# Altium schematic sheet Opto.SchDoc: Quad Optoisolator
size A4; DocumentNumber: 5; SheetNumber: 4; SheetTotal: 9
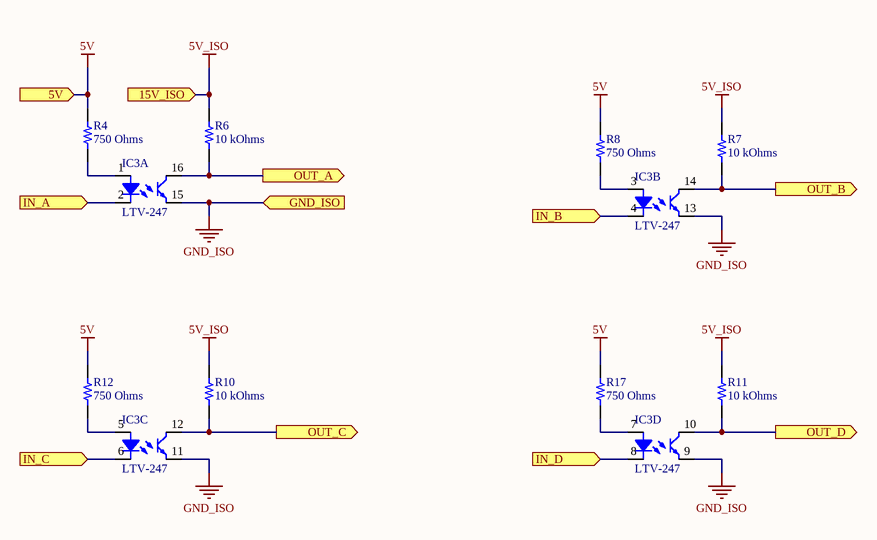
[diagram p0: Opto.SchDoc]

## Parts
IC3  LTV-247  [LITEON SOIC-16 LTV-247]  (parts A,B,C,D of 4)
R4  750 Ohms  [RES 0603_1608]
R6  10 kOhms  [RES 0603_1608]
R7  10 kOhms  [RES 0603_1608]
R8  750 Ohms  [RES 0603_1608]
R10  10 kOhms  [RES 0603_1608]
R11  10 kOhms  [RES 0603_1608]
R12  750 Ohms  [RES 0603_1608]
R17  750 Ohms  [RES 0603_1608]

## Ports
5V (in, see SSR_switch[2A], AC current measurement[1A], Connectors[3A], SSR_switch[1A], Supply 5V[2B], Supply 15V[2B]), 15V_ISO (in, see SSR_switch[2A], AC current measurement[1C], SSR_switch[1A]), GND_ISO (in, see SSR_switch[2A], AC current measurement[1D], SSR_switch[1B], Supply 5V[3C], Supply 15V[3C]), IN_A (in, see SSR_switch[2A]), IN_B (in, see SSR_switch[2A]), IN_C (in, see SSR_switch[2A]), IN_D (in, see SSR_switch[2A]), OUT_A (out, see SSR_switch[2A]), OUT_B (out, see SSR_switch[2A]), OUT_C (out, see SSR_switch[2A]), OUT_D (out, see SSR_switch[2A])

## Nets
5V: R4.2 R8.2 R12.1 R17.1 ; port 5V
5V_ISO: R6.2 R7.2 R10.2 R11.2 ; port 15V_ISO
GND_ISO: IC3.9 IC3.11 IC3.13 IC3.15 ; port GND_ISO
IN_A: IC3.2 ; port IN_A
IN_B: IC3.4 ; port IN_B
IN_C: IC3.6 ; port IN_C
IN_D: IC3.8 ; port IN_D
OUT_A: IC3.16 R6.1 ; port OUT_A
OUT_B: IC3.14 R7.1 ; port OUT_B
OUT_C: IC3.12 R10.1 ; port OUT_C
OUT_D: IC3.10 R11.1 ; port OUT_D
NetIC3_1: IC3.1 R4.1
NetIC3_3: IC3.3 R8.1
NetIC3_5: IC3.5 R12.2
NetIC3_7: IC3.7 R17.2

## Notes on the sheet
- Title
- Size:
- Date:
- A4
- Number:
- Time:
- Revision:
- Sheet
- of
- File:

## Library data of the parts
IC3 = LTV-247: OPTOISO 3.75KV 4CH TRANS 16SO; Manufacturer: Lite-On Inc.; Current - DC Forward (If) (Max): 50mA; Current Transfer Ratio (Max): 600% @ 5mA; Current Transfer Ratio (Min): 50% @ 5mA; Input Type: DC; Number of Channels: 4; Output Type: Transistor; Rise / Fall Time (Typ): 2µs, 3µs; Turn On / Turn Off Time (Typ): 3µs, 3µs; Vce Saturation (Max): 400mV; Voltage - Forward (Vf) (Typ): 1.2V; Voltage - Isolation: 3750Vrms; Voltage - Output (Max): 80V; Part Number: LTV-247; ComponentLink1Description: Datasheet; ComponentLink1URL: http://optoelectronics.liteon.com/upload/download/DS70-2009-0014/LTV-2X7%20sereis%20Mar17.PDF; ComponentLink2Description: DigiKey Link; ComponentLink2URL: http://digikey.com/product-detail/en/lite-on-inc/LTV-247/160-2255-1-ND/8042559; Current - Output / Channel: 50mA; LastUpdated: 6/12/2023 2:51:07 PM; Lifecycle Status: Active; Minimum Order: 1; Mounting Type: Surface Mount; Operating Temperature: -55°C ~ 110°C; Package / Case: 16-SOIC (0.173", 4.40mm Width); Packaging: TapeAndReel; Part Status: Active; Price: 0.43; Series: -; Supplier 1: DigiKey; Supplier Part Number 1: 160-2255-1-ND; Supplier Device Package: 16-SO
R4 R8 R12 R17 = RMCF0603FT750R: RES 750 OHM 1% 1/10W 0603; Manufacturer: Stackpole Electronics Inc; Power (Watts): 0.1W, 1/10W; Temperature Coefficient: ±100ppm/°C; Part Number: RMCF0603FT750R; Value: 750 Ohms; ComponentLink1Description: Datasheet; ComponentLink1URL: https://www.seielect.com/catalog/sei-rmcf_rmcp.pdf; ComponentLink2Description: DigiKey Link; ComponentLink2URL: https://www.digikey.com/en/products/detail/stackpole-electronics-inc/RMCF0603FT750R/1761094; Composition: Thick Film; Device Package: 0603 (1608 Metric); Features: Automotive AEC-Q200; Height - Seated (Max): 0.022" (0.55mm); LastUpdated: 6/19/2023 7:42:15 PM; Lifecycle Status: Active; Minimum Order: 1; Number of Terminations: 2; Operating Temperature: -55°C ~ 155°C; Package / Case: 0603 (1608 Metric); Packaging: CutTape; PartId: 10786; Part Status: Active; Price: 0.01; Ratings: AEC-Q200; Resistance: 750 Ohms; Series: RMCF; Size / Dimension: 0.061" L x 0.031" W (1.55mm x 0.80mm); Supplier 1: DigiKey; Supplier Part Number 1: RMCF0603FT750RCT-ND; Supplier Device Package: 0603; Tolerance: ±1%
R6 R7 R10 R11 = SG73S1JTTD1002F: RES 10K OHM 1% 1/5W 0603; Manufacturer: KOA Speer Electronics, Inc.; Power (Watts): 0.2W, 1/5W; Temperature Coefficient: ±100ppm/°C; Part Number: SG73S1JTTD1002F; Value: 10 kOhms; ComponentLink1Description: Datasheet; ComponentLink1URL: http://www.koaspeer.com/catimages/Products/SG73S/SG73S.pdf; ComponentLink2Description: DigiKey Link; ComponentLink2URL: https://www.digikey.com/en/products/detail/koa-speer-electronics-inc/SG73S1JTTD1002F/10279969; Composition: Thick Film; Device Package: 0603 (1608 Metric); Features: Automotive AEC-Q200, Moisture Resistant, Pulse Withstanding; Height - Seated (Max): 0.022" (0.55mm); LastUpdated: 6/13/2023 8:14:59 PM; Lifecycle Status: Active; Minimum Order: 1; Number of Terminations: 2; Operating Temperature: -55°C ~ 155°C; Package / Case: 0603 (1608 Metric); Packaging: TapeAndReel; PartId: 5386; Part Status: Active; Price: 0.01; Ratings: AEC-Q200; Resistance: 10 kOhms; Series: SG73S; Size / Dimension: 0.063" L x 0.031" W (1.60mm x 0.80mm); Supplier 1: DigiKey; Supplier Part Number 1: 2019-SG73S1JTTD1002FCT-ND; Supplier Device Package: 0603; Tolerance: ±1%